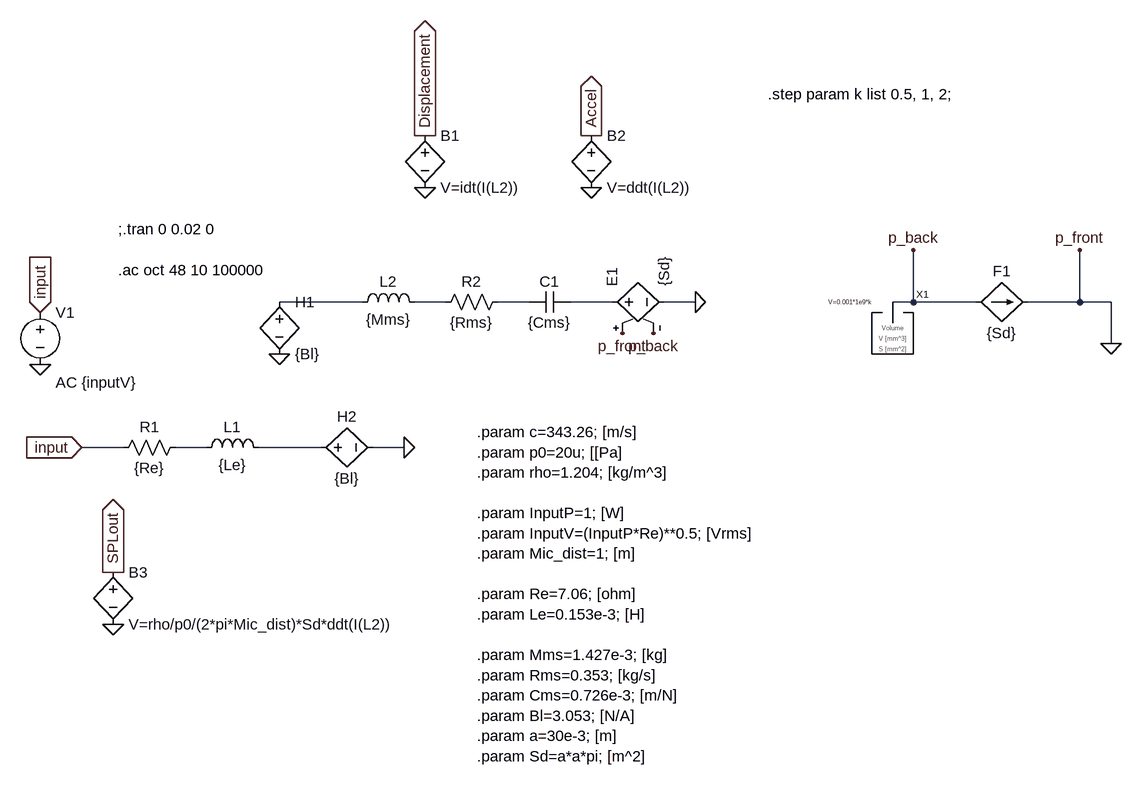
[diagram p0: schematic demo_07.asc]
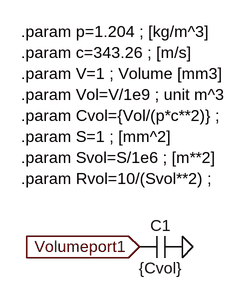
[diagram p1: sub-circuit volumemodel.asc]
demo_07.asc, the LTspice schematic file:
Version 4
SHEET 1 1700 776
WIRE 528 112 400 112
WIRE 656 112 608 112
WIRE 784 112 736 112
WIRE 912 112 848 112
WIRE 1040 112 992 112
WIRE 1376 112 1376 32
WIRE 1376 112 1344 112
WIRE 1472 112 1376 112
WIRE 1632 112 1632 32
WIRE 1632 112 1552 112
WIRE 1680 112 1632 112
WIRE 1680 176 1680 112
WIRE 160 336 96 336
WIRE 288 336 240 336
WIRE 464 336 368 336
WIRE 592 336 544 336
FLAG 32 208 0
FLAG 32 128 input
IOPIN 32 128 In
FLAG 592 336 0
FLAG 96 336 input
IOPIN 96 336 In
FLAG 1040 112 0
FLAG 624 -64 0
FLAG 880 -64 0
FLAG 624 -144 Displacement
IOPIN 624 -144 Out
FLAG 880 -144 Accel
IOPIN 880 -144 Out
FLAG 400 192 0
FLAG 144 608 0
FLAG 144 528 SPLout
IOPIN 144 528 Out
FLAG 1680 176 0
FLAG 1376 32 p_back
FLAG 1632 32 p_front
FLAG 976 160 p_back
FLAG 928 160 p_front
SYMBOL voltage 32 112 R0
WINDOW 123 24 124 Left 2
WINDOW 39 0 0 Left 0
SYMATTR Value2 AC {inputV}
SYMATTR InstName V1
SYMATTR Value ""
SYMBOL res 144 352 R270
WINDOW 0 32 56 VTop 2
WINDOW 3 0 56 VBottom 2
SYMATTR InstName R1
SYMATTR Value {Re}
SYMBOL ind 272 352 R270
WINDOW 0 32 56 VTop 2
WINDOW 3 5 56 VBottom 2
SYMATTR InstName L1
SYMATTR Value {Le}
SYMBOL ind 512 128 R270
WINDOW 0 32 56 VTop 2
WINDOW 3 5 56 VBottom 2
SYMATTR InstName L2
SYMATTR Value {Mms}
SYMBOL res 640 128 R270
WINDOW 0 32 56 VTop 2
WINDOW 3 0 56 VBottom 2
SYMATTR InstName R2
SYMATTR Value {Rms}
SYMBOL cap 784 128 R270
WINDOW 0 32 32 VTop 2
WINDOW 3 0 32 VBottom 2
SYMATTR InstName C1
SYMATTR Value {Cms}
SYMBOL bv 624 -160 R0
SYMATTR InstName B1
SYMATTR Value V=idt(I(L2))
SYMBOL bv 880 -160 R0
SYMATTR InstName B2
SYMATTR Value V=ddt(I(L2))
SYMBOL h 400 96 R0
SYMATTR InstName H1
SYMATTR Value {Bl}
SYMATTR SpiceModel L1
SYMBOL h 448 336 R270
WINDOW 0 32 56 VTop 2
WINDOW 3 -32 56 VBottom 2
SYMATTR InstName H2
SYMATTR Value {Bl}
SYMATTR SpiceModel L2
SYMBOL bv 144 512 R0
SYMATTR InstName B3
SYMATTR Value V=rho/p0/(2*pi*Mic_dist)*Sd*ddt(I(L2))
SYMBOL f 1472 112 R270
WINDOW 0 32 40 VTop 2
WINDOW 3 -32 40 VBottom 2
SYMATTR InstName F1
SYMATTR Value {Sd}
SYMATTR SpiceModel L2
SYMBOL e 896 112 R270
SYMATTR InstName E1
SYMATTR Value {Sd}
SYMBOL My_symbol\\VolumeModel 1344 112 R0
WINDOW 39 -99 0 Left 0
SYMATTR SpiceLine V=0.001*1e9*k
SYMATTR InstName X1
TEXT 152 0 Left 2 !;.tran 0 0.02 0\n\n.ac oct 48 10 100000
TEXT 704 312 Left 2 !.param c=343.26; [m/s]\n.param p0=20u; [[Pa]\n.param rho=1.204; [kg/m^3]\n \n.param InputP=1; [W] \n.param InputV=(InputP*Re)**0.5; [Vrms]\n.param Mic_dist=1; [m]\n \n.param Re=7.06; [ohm]\n.param Le=0.153e-3; [H]\n \n.param Mms=1.427e-3; [kg]\n.param Rms=0.353; [kg/s]\n.param Cms=0.726e-3; [m/N]\n.param Bl=3.053; [N/A]\n.param a=30e-3; [m]\n.param Sd=a*a*pi; [m^2]
TEXT 1152 -208 Left 2 !.step param k list 0.5, 1, 2;

volumemodel.asc, the sub-circuit schematic file:
Version 4
SHEET 1 1216 680
FLAG 384 480 Volumeport1
IOPIN 384 480 In
FLAG 448 480 0
SYMBOL cap 448 464 R90
WINDOW 0 0 32 VBottom 2
WINDOW 3 32 32 VTop 2
SYMATTR InstName C1
SYMATTR Value {Cvol}
SYMATTR SpiceLine Rpar={Rvol}
TEXT 208 160 Left 2 !.param p=1.204 ; [kg/m^3]\n.param c=343.26 ; [m/s]\n.param V=1 ; Volume [mm3]\n.param Vol=V/1e9 ; unit m^3\n.param Cvol={Vol/(p*c**2)} ;\n.param S=1 ; [mm^2]\n.param Svol=S/1e6 ; [m**2]\n.param Rvol=10/(Svol**2) ;

The netlist it stands for:
* demo_07.asc
V1 input 0 AC {inputV}
R1 input N005 {Re}
L1 N005 N006 {Le}
L2 N001 N002 {Mms}
R2 N002 N003 {Rms}
C1 N003 N004 {Cms}
B1 Displacement 0 V=idt(I(L2))
B2 Accel 0 V=ddt(I(L2))
H1 N001 0 L1 {Bl}
H2 N006 0 L2 {Bl}
B3 SPLout 0 V=rho/p0/(2*pi*Mic_dist)*Sd*ddt(I(L2))
F1 p_back 0 L2 {Sd}
E1 N004 0 0 p_back {Sd}
XX1 p_back volumemodel params: V=0.001*1e9*k

* block symbol definitions
.subckt volumemodel Volumeport1
C1 0 Volumeport1 {Cvol} Rpar={Rvol}
.param p=1.204 ; [kg/m^3]
.param c=343.26 ; [m/s]
.param V=1 ; Volume [mm3]
.param Vol=V/1e9 ; unit m^3
.param Cvol={Vol/(p*c**2)} ;
.param S=1 ; [mm^2]
.param Svol=S/1e6 ; [m**2]
.param Rvol=10/(Svol**2) ;
.ends volumemodel

;.tran 0 0.02 0
.ac oct 48 10 100000
.param c=343.26; [m/s]
.param p0=20u; [[Pa]
.param rho=1.204; [kg/m^3]
.param InputP=1; [W]
.param InputV=(InputP*Re)**0.5; [Vrms]
.param Mic_dist=1; [m]
.param Re=7.06; [ohm]
.param Le=0.153e-3; [H]
.param Mms=1.427e-3; [kg]
.param Rms=0.353; [kg/s]
.param Cms=0.726e-3; [m/N]
.param Bl=3.053; [N/A]
.param a=30e-3; [m]
.param Sd=a*a*pi; [m^2]
.step param k list 0.5, 1, 2;
.backanno
.end

* Results of the author's LTspice run, read from the files saved beside the schematic
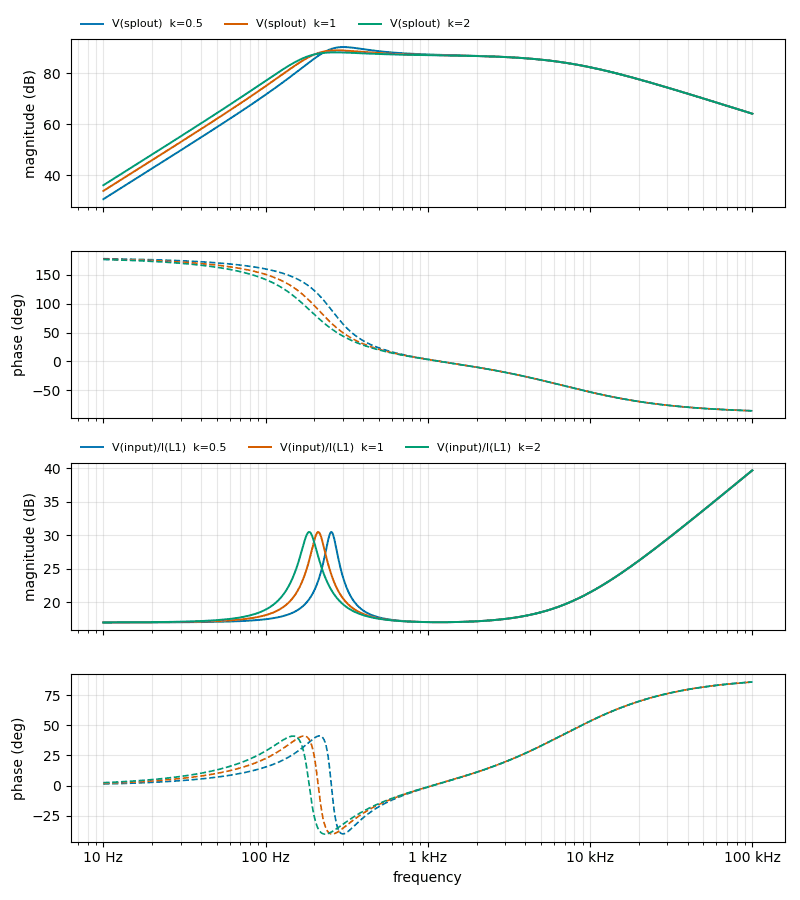
[diagram p2: AC Analysis of demo_07.asc, plotted from the saved traces]
* AC Analysis, 3 runs:
*   V(splout) [k=0.5]: 30.56 dB at 10 Hz, 64.07 dB at 100 kHz, peak 90.20 dB at 302 Hz, 3 dB below the peak at 216.1 Hz and 1.116 kHz
*   V(splout) [k=1]: 33.80 dB at 10 Hz, 64.07 dB at 100 kHz, peak 88.90 dB at 273 Hz, 3 dB below the peak at 180.2 Hz and 3.824 kHz
*   V(splout) [k=2]: 36.03 dB at 10 Hz, 64.07 dB at 100 kHz, peak 88.12 dB at 269.1 Hz, 3 dB below the peak at 161 Hz and 5.25 kHz
*   V(input)/I(L1) [k=0.5]: 16.98 dB at 10 Hz, 39.68 dB at 100 kHz, peak 39.68 dB at 100 kHz, 3 dB below the peak at 70.53 kHz
*   V(input)/I(L1) [k=1]: 16.98 dB at 10 Hz, 39.68 dB at 100 kHz, peak 39.68 dB at 100 kHz, 3 dB below the peak at 70.53 kHz
*   V(input)/I(L1) [k=2]: 16.99 dB at 10 Hz, 39.68 dB at 100 kHz, peak 39.68 dB at 100 kHz, 3 dB below the peak at 70.53 kHz